# Altium schematic sheet Socket&Hole.SchDoc: Socket&Hole.SchDoc
size A4; CheckedBy: fx; Author: flotox@yeah.net; Revision: v1.0.0; SheetNumber: 10; SheetTotal: 10
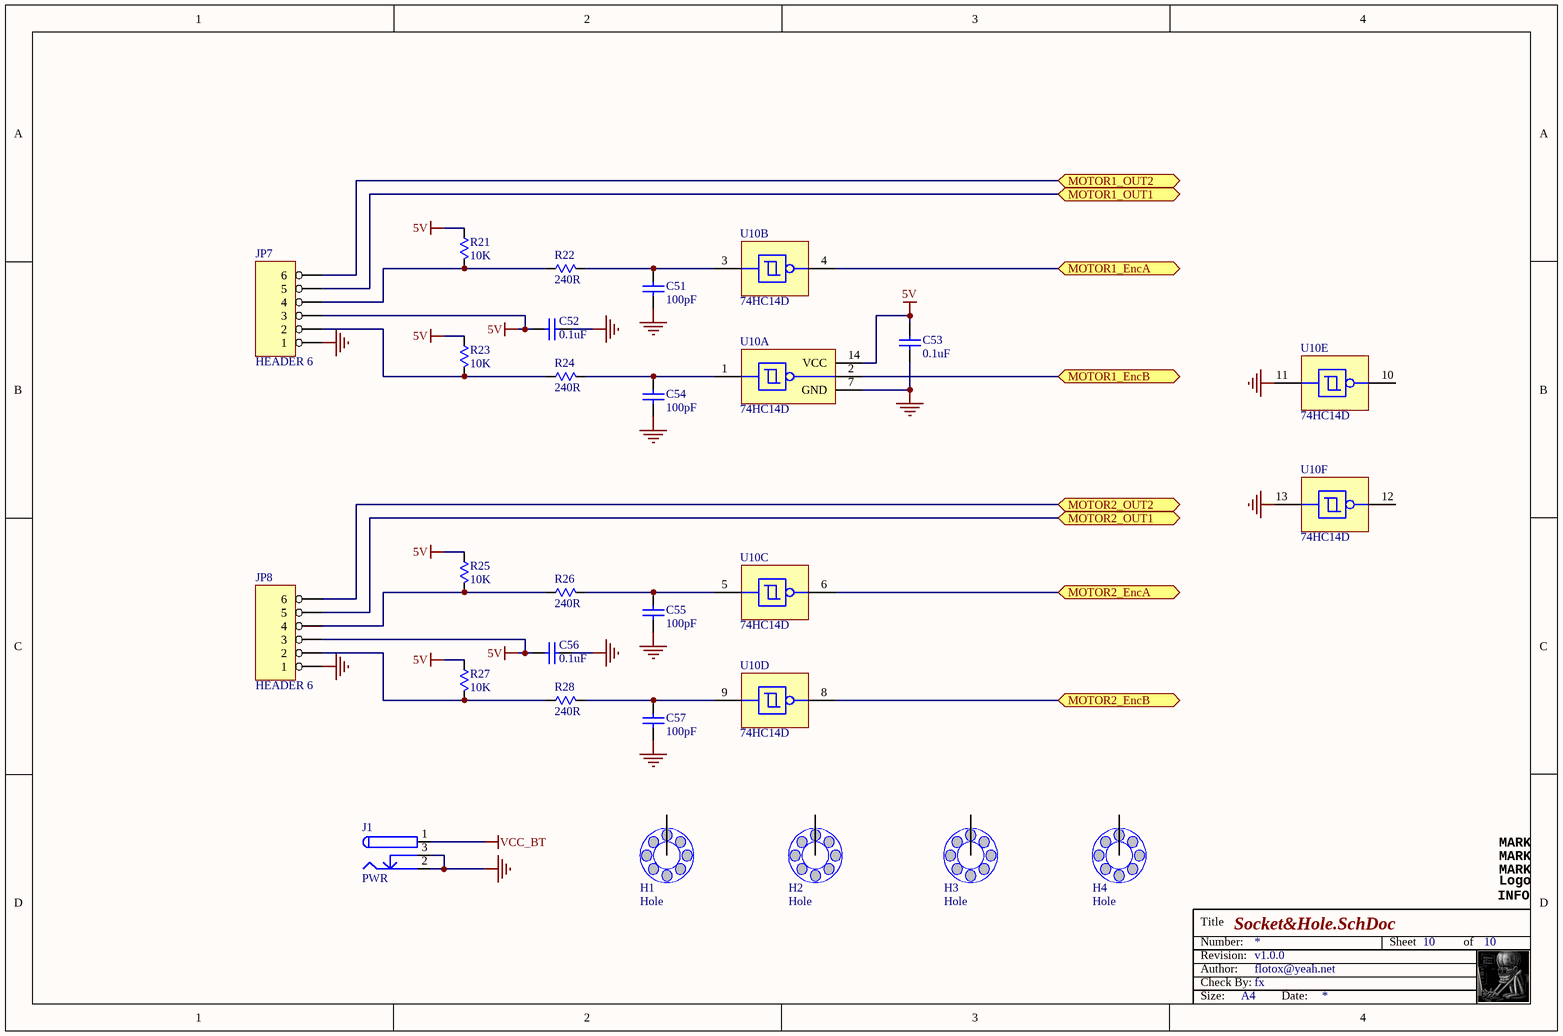
[diagram p0: Socket&Hole.SchDoc]

## Parts
C51  100pF  [C0603-S]
C52  0.1uF  [C0603-S]
C53  0.1uF  [C0603-S]
C54  100pF  [C0603-S]
C55  100pF  [C0603-S]
C56  0.1uF  [C0603-S]
C57  100pF  [C0603-S]
H1  Hole  [HT-M3-S]
H2  Hole  [HT-M3-S]
H3  Hole  [HT-M3-S]
H4  Hole  [HT-M3-S]
INFO1  INFO  [FX_DESIGN_INFO]  (value not drawn)
J1  PWR  [POWER-A]
JP7  HEADER 6  [WHDR2.0X6]
JP8  HEADER 6  [WHDR2.0X6]
LG1  LOGO  [Hat_Logo]  (value not drawn)
MARK1  MARK  [MARK-S]  (value not drawn)
MARK2  MARK  [MARK-S]  (value not drawn)
MARK3  MARK  [MARK-S]  (value not drawn)
R21  10K  [R0603-S]
R22  240R  [R0603-S]
R23  10K  [R0603-S]
R24  240R  [R0603-S]
R25  10K  [R0603-S]
R26  240R  [R0603-S]
R27  10K  [R0603-S]
R28  240R  [R0603-S]
U10  74HC14D  [SO14-150]  (parts A,B,C,D,E,F of 6)

## Ports
MOTOR1_EncA, MOTOR1_EncB, MOTOR1_OUT1, MOTOR1_OUT2, MOTOR2_EncA, MOTOR2_EncB, MOTOR2_OUT1, MOTOR2_OUT2

## Nets
5V: C52.1 C53.1 C56.1 JP7.3 JP8.3 R21.2 R23.2 R25.2 R27.2 U10.14(VCC)
GND: C51.1 C52.2 C53.2 C54.1 C55.1 C56.2 C57.1 J1.2 J1.3 JP7.1 JP8.1 U10.7(GND) U10.11(A) U10.13(A)
VCC_BT: J1.1
MOTOR1_EncA: U10.4(Y) ; port MOTOR1_EncA
MOTOR1_EncB: U10.2(Y) ; port MOTOR1_EncB
MOTOR1_OUT1: JP7.5 ; port MOTOR1_OUT1
MOTOR1_OUT2: JP7.6 ; port MOTOR1_OUT2
MOTOR2_EncA: U10.6(Y) ; port MOTOR2_EncA
MOTOR2_EncB: U10.8(Y) ; port MOTOR2_EncB
MOTOR2_OUT1: JP8.5 ; port MOTOR2_OUT1
MOTOR2_OUT2: JP8.6 ; port MOTOR2_OUT2
NetC51_2: C51.2 R22.1 U10.3(A)
NetC54_2: C54.2 R24.1 U10.1(A)
NetC55_2: C55.2 R26.1 U10.5(A)
NetC57_2: C57.2 R28.1 U10.9(A)
NetJP7_2: JP7.2 R23.1 R24.2
NetJP7_4: JP7.4 R21.1 R22.2
NetJP8_2: JP8.2 R27.1 R28.2
NetJP8_4: JP8.4 R25.1 R26.2

Not connected (* = marked no-connect by the designer): H1 1; H2 1; H3 1; H4 1; U10 10(Y) 12(Y)

## Notes on the sheet
- Title
- Revision:
- Number:
- Author:
- Check By:
- Sheet
- of
- Size:
- A4
- Date:
- (in symbol LOGO) Logo

## Library data of the parts
C51-C57 = CAP: Capacitor
H1-H4 = Hole: Mounting holes
R21-R28 = RES: Resistor
U10 = 74HC14D: Hex inverting Schmitt trigger